# EAGLE schematic Works_007_a (EAGLE 8.2.1)
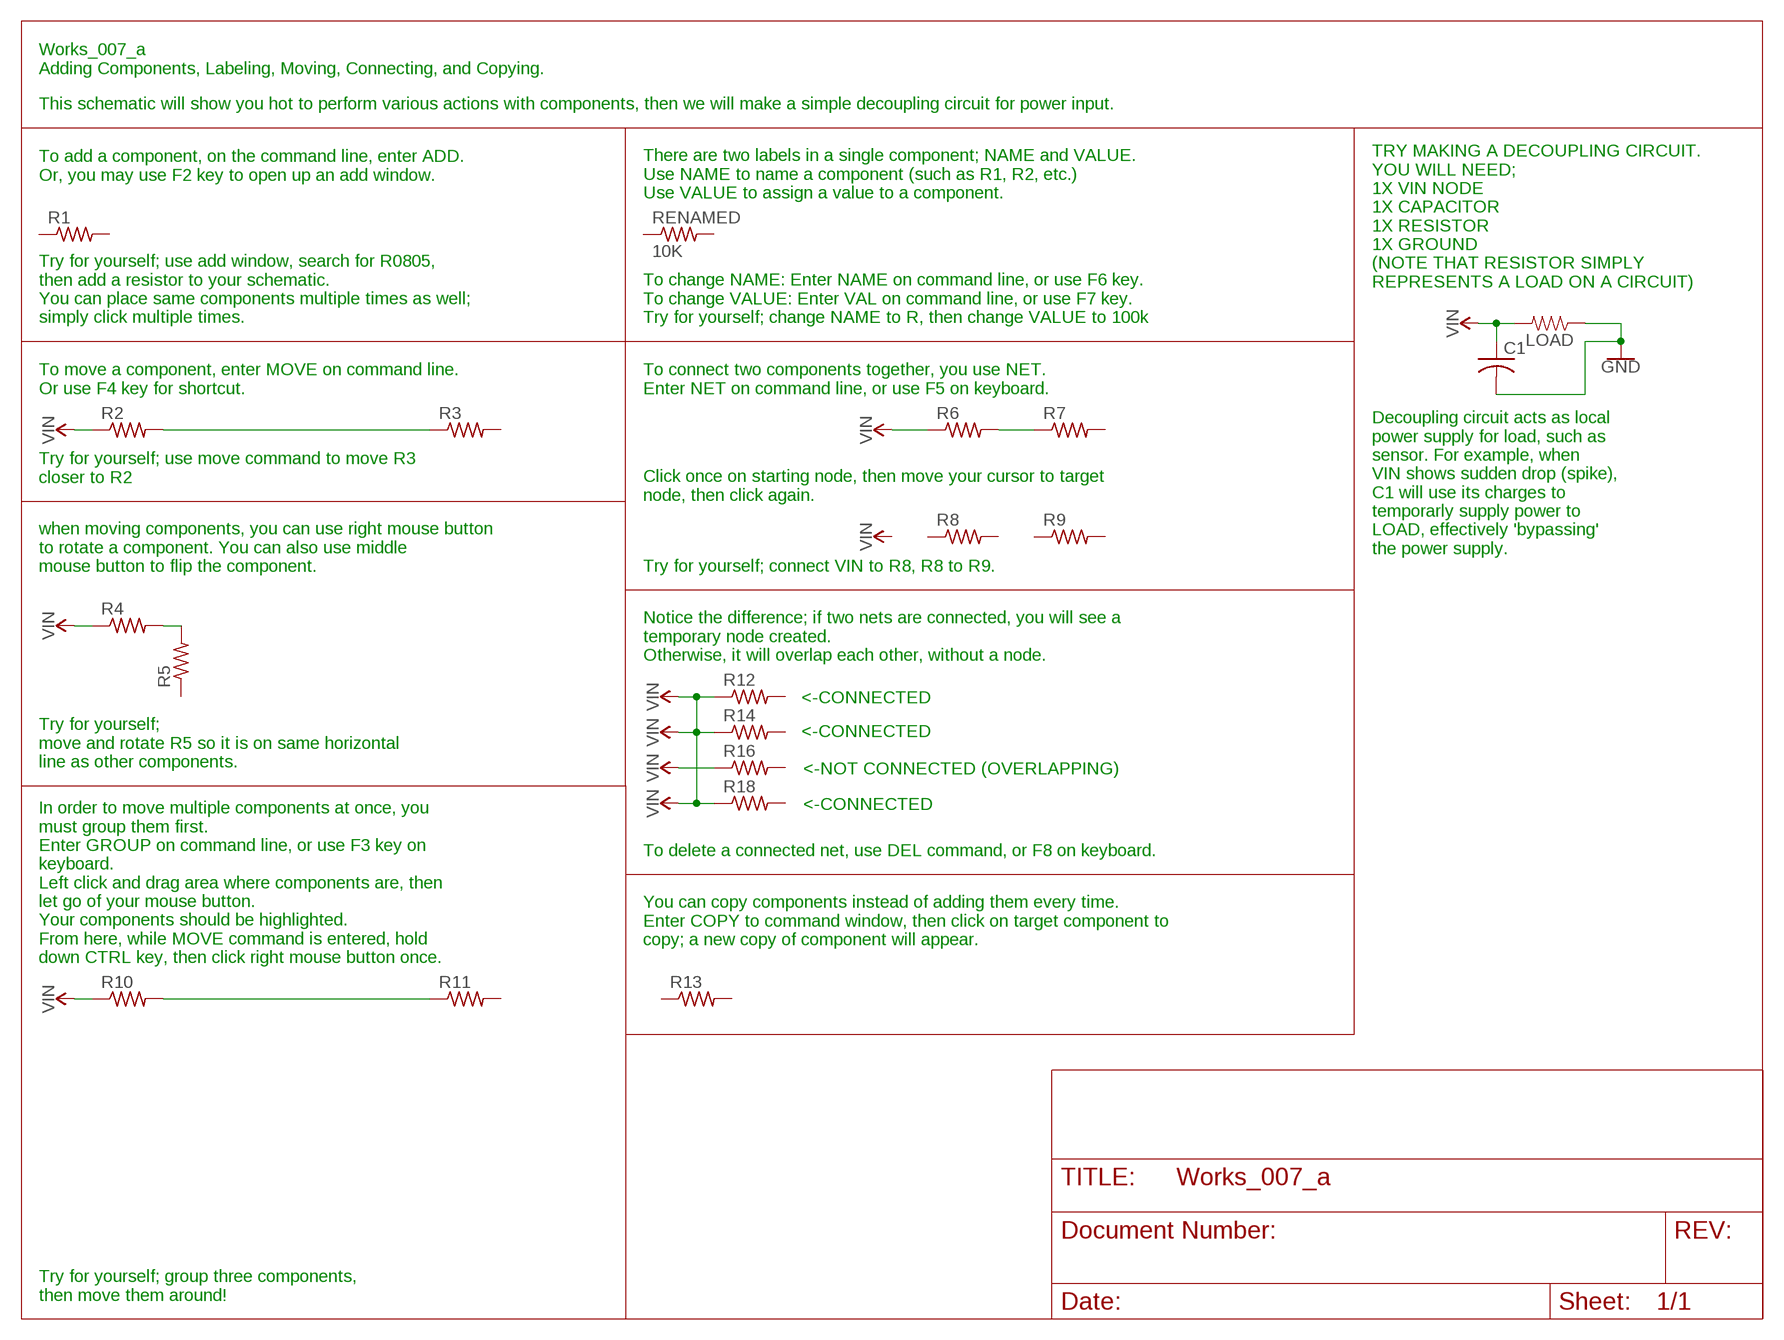
[diagram p0: schematic, sheet 1]

## Parts
C1  C-USC0805  [C0805]
LOAD  RESISTOR0805  [0805]
R1  R-US_R0805  [R0805]
R2  R-US_R0805  [R0805]
R3  R-US_R0805  [R0805]
R4  R-US_R0805  [R0805]
R5  R-US_R0805  [R0805]
R6  R-US_R0805  [R0805]
R7  R-US_R0805  [R0805]
R8  R-US_R0805  [R0805]
R9  R-US_R0805  [R0805]
R10  R-US_R0805  [R0805]
R11  R-US_R0805  [R0805]
R12  R-US_R0805  [R0805]
R13  R-US_R0805  [R0805]
R14  R-US_R0805  [R0805]
R16  R-US_R0805  [R0805]
R18  R-US_R0805  [R0805]
RENAMED  10K  R-US_R0805  [R0805]

## Nets
GND: C1.2 LOAD.1
N$1: R2.2 R3.1
N$2: R4.2 R5.2
N$3: R6.2 R7.1
N$4: R10.2 R11.1
VIN: C1.1 LOAD.2 R2.1 R4.1 R6.1 R10.1 R12.1 R14.1 R16.1 R18.1
Unconnected: R1.1 R1.2 R3.2 R5.1 R7.2 R8.1 R8.2 R9.1 R9.2 R11.2 R12.2 R13.1 R13.2 R14.2 R16.2 R18.2 RENAMED.1 RENAMED.2

## Notes on the sheet
- Works_007_a
  Adding Components, Labeling, Moving, Connecting, and Copying.
- This schematic will show you hot to perform various actions with components, then we will make a simple decoupling circuit for power input.
- To add a component, on the command line, enter ADD.
  Or, you may use F2 key to open up an add window.
- There are two labels in a single component; NAME and VALUE.
  Use NAME to name a component (such as R1, R2, etc.)
  Use VALUE to assign a value to a component.
- TRY MAKING A DECOUPLING CIRCUIT.
  YOU WILL NEED;
  1X VIN NODE
  1X CAPACITOR
  1X RESISTOR
  1X GROUND
  (NOTE THAT RESISTOR SIMPLY
  REPRESENTS A LOAD ON A CIRCUIT)
- Try for yourself; use add window, search for R0805,
  then add a resistor to your schematic.
  You can place same components multiple times as well;
  simply click multiple times.
- To change NAME: Enter NAME on command line, or use F6 key.
  To change VALUE: Enter VAL on command line, or use F7 key.
  Try for yourself; change NAME to R, then change VALUE to 100k
- To move a component, enter MOVE on command line.
  Or use F4 key for shortcut.
- To connect two components together, you use NET.
  Enter NET on command line, or use F5 on keyboard.
- Try for yourself; use move command to move R3 
  closer to R2
- Click once on starting node, then move your cursor to target
  node, then click again.
- Decoupling circuit acts as local
  power supply for load, such as
  sensor. For example, when 
  VIN shows sudden drop (spike),
  C1 will use its charges to 
  temporarly supply power to 
  LOAD, effectively 'bypassing'
  the power supply.
- when moving components, you can use right mouse button
  to rotate a component. You can also use middle
  mouse button to flip the component.
- Try for yourself; connect VIN to R8, R8 to R9.
- Notice the difference; if two nets are connected, you will see a
  temporary node created.
  Otherwise, it will overlap each other, without a node.
- <-CONNECTED
- <-CONNECTED
- Try for yourself;
  move and rotate R5 so it is on same horizontal
  line as other components.
- <-NOT CONNECTED (OVERLAPPING)
- <-CONNECTED
- To delete a connected net, use DEL command, or F8 on keyboard.
- You can copy components instead of adding them every time.
  Enter COPY to command window, then click on target component to
  copy; a new copy of component will appear.
- In order to move multiple components at once, you
  must group them first.
  Enter GROUP on command line, or use F3 key on
  keyboard.
  Left click and drag area where components are, then
  let go of your mouse button.
  Your components should be highlighted.
  From here, while MOVE command is entered, hold
  down CTRL key, then click right mouse button once.
- Try for yourself; group three components,
  then move them around!

## Library data of the parts
C1 = resistor:C-US: CAPACITOR, American symbol
LOAD = SparkFun-Resistors:RESISTOR: Generic Resistor Package
R1-R14 R16 R18 RENAMED = adafruit:R-US_: RESISTOR, American symbol